# Altium project EMIRemover.PrjPcb
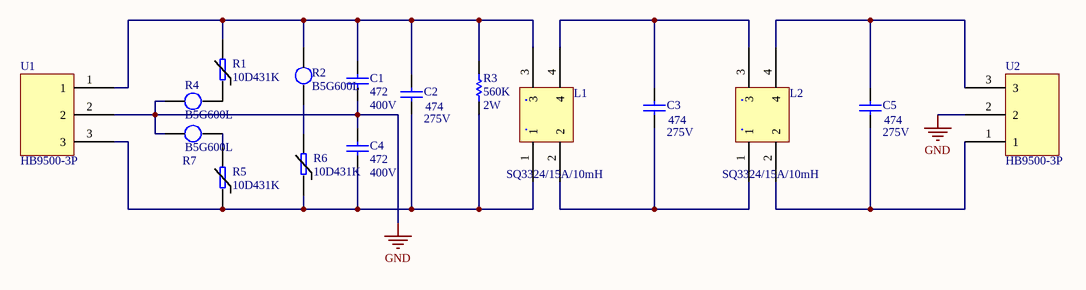
[diagram p0: EMIRemover.SchDoc]
1 sheet, 16 parts. Net scope: global (net labels, ports and power ports of the same name join across sheets).
Board file: EMIRemover.PcbDoc

## Sheet EMIRemover.SchDoc
size A3; SheetNumber: 1; SheetTotal: 1

### Parts
C1  400V  value 472  [RAD-0.4]
C2  275V  value 474  [CAPCDSPC]
C3  275V  value 474  [CAPCDSPC]
C4  400V  value 472  [RAD-0.4]
C5  275V  value 474  [CAPCDSPC]
L1  SQ3324/15A/10mH  [SQ3324]
L2  SQ3324/15A/10mH  [SQ3324]
R1  10D431K  [10D431K]
R2  B5G600L  [B5G600L]
R3  2W  value 560K  [AXIAL-0.7]
R4  B5G600L  [B5G600L]
R5  10D431K  [10D431K]
R6  10D431K  [10D431K]
R7  B5G600L  [B5G600L]
U1  HB9500-3P  [HB9500-3P]
U2  HB9500-3P  [HB9500-3P]

### Nets
GND: C1.2 C4.1 R4.1 R7.1 U1.2 U2.2
NetC1_1: C1.1 C2.1 L1.3 R1.1 R2.1 R3.1 U1.1
NetC2_2: C2.2 C4.2 L1.1 R3.2 R5.2 R6.2 U1.3
NetC3_1: C3.1 L1.4 L2.3
NetC3_2: C3.2 L1.2 L2.1
NetC5_1: C5.1 L2.4 U2.3
NetC5_2: C5.2 L2.2 U2.1
NetR1_2: R1.2 R4.2
NetR2_2: R2.2 R6.1
NetR5_1: R5.1 R7.2

### Library data of the parts
C1-C5 = Cap: Capacitor; Published: 8-Jun-2000; LatestRevisionDate: 17-Jul-2002; LatestRevisionNote: Re-released for DXP Platform.; PackageReference: RAD-0.3; Publisher: Altium Limited; PackageDescription: Radial Cap, Thru-Hole; 2 Leads; 0.3 in Pin Spacing
L1 L2 = SQ3324
R3 = Res1: Resistor; Published: 8-Jun-2000; LatestRevisionDate: 17-Jul-2002; LatestRevisionNote: Re-released for DXP Platform.; PackageReference: AXIAL-0.3; Publisher: Altium Limited; PackageDescription: Axial Device, Thru-Hole; 2 Leads; 0.3 in Pin Spacing